# Altium schematic sheet STM32F407VG-C.SchDoc
size A4
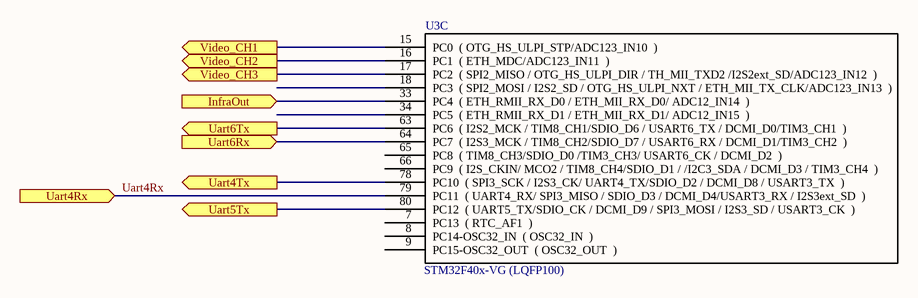
[diagram p0: STM32F407VG-C.SchDoc]

## Parts
U3  STM32F40x-VG (LQFP100)  [LQFP100_N]  (part C of 6)

## Ports
InfraOut (in), Uart4Rx (in), Uart4Tx (out), Uart5Tx (out), Uart6Rx (in), Uart6Tx (out), Video_CH1 (out), Video_CH2 (out), Video_CH3 (out)

## Nets
InfraOut: U3.33(PC4__(_ETH_RMII_RX_D0_/_ETH_MII_RX_D0/_ADC12_IN14__)) ; port InfraOut
Uart4Rx: U3.79(PC11__(_UART4_RX/_SPI3_MISO_/_SDIO_D3_/_DCMI_D4/USART3_RX_/_I2S3ext_SD__)) ; port Uart4Rx
Uart4Tx: U3.78(PC10__(_SPI3_SCK_/_I2S3_CK/_UART4_TX/SDIO_D2_/_DCMI_D8_/_USART3_TX__)) ; port Uart4Tx
Uart5Tx: U3.80(PC12__(_UART5_TX/SDIO_CK_/_DCMI_D9_/_SPI3_MOSI_/_I2S3_SD_/_USART3_CK__)) ; port Uart5Tx
Uart6Rx: U3.64(PC7__(_I2S3_MCK_/_TIM8_CH2/SDIO_D7_/_USART6_RX_/_DCMI_D1/TIM3_CH2__)) ; port Uart6Rx
Uart6Tx: U3.63(PC6__(_I2S2_MCK_/_TIM8_CH1/SDIO_D6_/_USART6_TX_/_DCMI_D0/TIM3_CH1__)) ; port Uart6Tx
Video_CH1: U3.15(PC0__(_OTG_HS_ULPI_STP/ADC123_IN10__)) ; port Video_CH1
Video_CH2: U3.16(PC1__(_ETH_MDC/ADC123_IN11__)) ; port Video_CH2
Video_CH3: U3.17(PC2__(_SPI2_MISO_/_OTG_HS_ULPI_DIR_/_TH_MII_TXD2_/I2S2ext_SD/ADC123_IN12__)) ; port Video_CH3

Not connected (* = marked no-connect by the designer): U3 7(PC13__(_RTC_AF1__)) 8(PC14-OSC32_IN__(_OSC32_IN__)) 9(PC15-OSC32_OUT__(_OSC32_OUT__)) 18(PC3__(_SPI2_MOSI_/_I2S2_SD_/_OTG_HS_ULPI_NXT_/_ETH_MII_TX_CLK/ADC123_IN13__)) 34(PC5__(_ETH_RMII_RX_D1_/_ETH_MII_RX_D1/_ADC12_IN15__)) 65(PC8__(_TIM8_CH3/SDIO_D0_/TIM3_CH3/_USART6_CK_/_DCMI_D2__)) 66(PC9__(_I2S_CKIN/_MCO2_/_TIM8_CH4/SDIO_D1_/_/I2C3_SDA_/_DCMI_D3_/_TIM3_CH4__))

## Library data of the parts
U3 = STM32F40x-VG